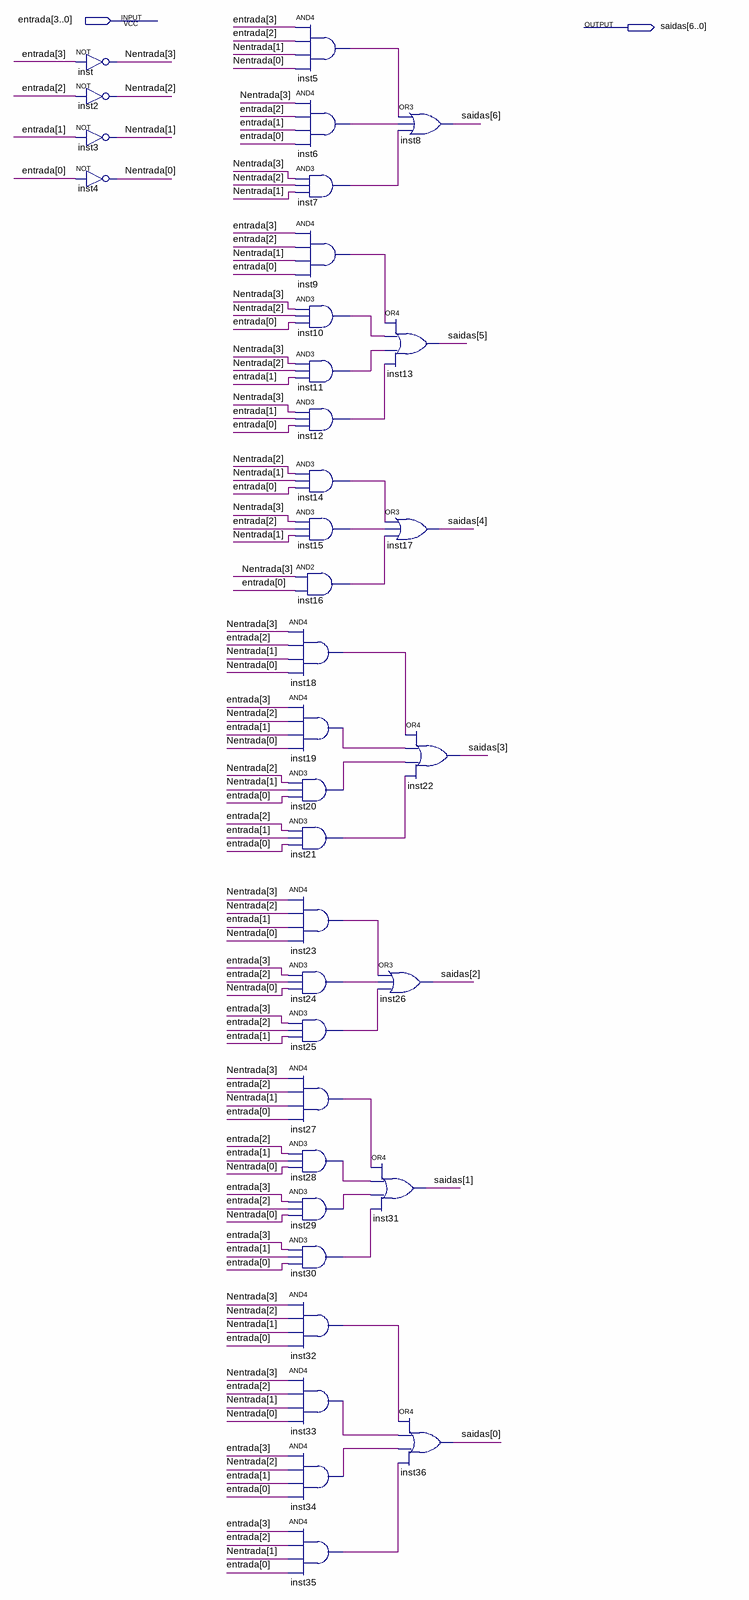
[diagram p0: schematic sheet]
// Quartus schematic CONVERSOR_7SEGMENTOS.bdf as structural Verilog: 36 symbols, 2 pins
module CONVERSOR_7SEGMENTOS (
  input  [3:0] entrada,
  output [6:0] saidas
);

  wire inst5_out, inst6_out, inst7_out, inst9_out, inst10_out, inst11_out, inst12_out, inst14_out,
       inst15_out, inst16_out, inst18_out, inst19_out, inst20_out, inst21_out, inst23_out, inst24_out,
       inst25_out, inst27_out, inst28_out, inst29_out, inst30_out, inst32_out, inst33_out, inst34_out,
       inst35_out;
  wire [3:0] Nentrada;

  not inst (Nentrada[3], entrada[3]);
  not inst2 (Nentrada[2], entrada[2]);
  not inst3 (Nentrada[1], entrada[1]);
  not inst4 (Nentrada[0], entrada[0]);
  and inst18 (inst18_out, Nentrada[3], entrada[2], Nentrada[1], Nentrada[0]);
  and inst19 (inst19_out, entrada[3], Nentrada[2], entrada[1], Nentrada[0]);
  and inst20 (inst20_out, Nentrada[2], Nentrada[1], entrada[0]);
  and inst21 (inst21_out, entrada[2], entrada[1], entrada[0]);
  and inst23 (inst23_out, Nentrada[3], Nentrada[2], entrada[1], Nentrada[0]);
  and inst24 (inst24_out, entrada[3], entrada[2], Nentrada[0]);
  and inst25 (inst25_out, entrada[3], entrada[2], entrada[1]);
  and inst27 (inst27_out, Nentrada[3], entrada[2], Nentrada[1], entrada[0]);
  and inst28 (inst28_out, entrada[2], entrada[1], Nentrada[0]);
  and inst29 (inst29_out, entrada[3], entrada[2], Nentrada[0]);
  and inst30 (inst30_out, entrada[3], entrada[1], entrada[0]);
  and inst32 (inst32_out, Nentrada[3], Nentrada[2], Nentrada[1], entrada[0]);
  and inst33 (inst33_out, Nentrada[3], entrada[2], Nentrada[1], Nentrada[0]);
  and inst34 (inst34_out, entrada[3], Nentrada[2], entrada[1], entrada[0]);
  and inst35 (inst35_out, entrada[3], entrada[2], Nentrada[1], entrada[0]);
  and inst5 (inst5_out, entrada[3], entrada[2], Nentrada[1], Nentrada[0]);
  and inst6 (inst6_out, Nentrada[3], entrada[2], entrada[1], entrada[0]);
  and inst7 (inst7_out, Nentrada[3], Nentrada[2], Nentrada[1]);
  and inst9 (inst9_out, entrada[3], entrada[2], Nentrada[1], entrada[0]);
  and inst10 (inst10_out, Nentrada[3], Nentrada[2], entrada[0]);
  and inst11 (inst11_out, Nentrada[3], Nentrada[2], entrada[1]);
  and inst12 (inst12_out, Nentrada[3], entrada[1], entrada[0]);
  and inst14 (inst14_out, Nentrada[2], Nentrada[1], entrada[0]);
  and inst15 (inst15_out, Nentrada[3], entrada[2], Nentrada[1]);
  and inst16 (inst16_out, Nentrada[3], entrada[0]);
  or inst8 (saidas[6], inst5_out, inst6_out, inst7_out);
  or inst13 (saidas[5], inst9_out, inst10_out, inst11_out, inst12_out);
  or inst17 (saidas[4], inst14_out, inst15_out, inst16_out);
  or inst26 (saidas[2], inst23_out, inst24_out, inst25_out);
  or inst31 (saidas[1], inst27_out, inst28_out, inst29_out, inst30_out);
  or inst36 (saidas[0], inst32_out, inst33_out, inst34_out, inst35_out);
  or inst22 (saidas[3], inst18_out, inst19_out, inst20_out, inst21_out);
endmodule
